# Altium schematic sheet Pressure_BMP280.SchDoc: BMP280
size 203 x 127 mm
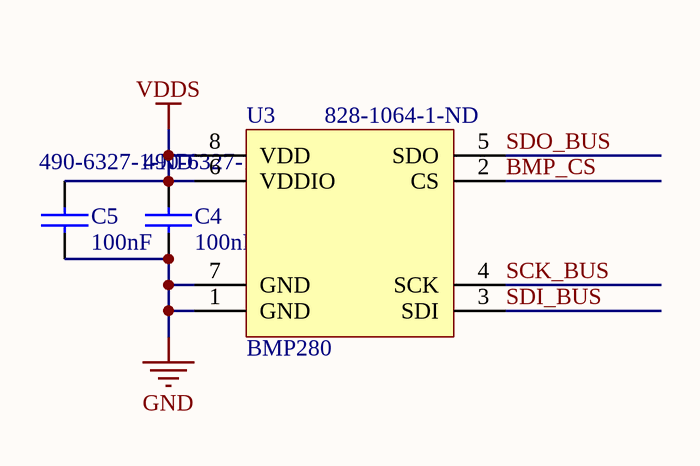
[diagram p0: Pressure_BMP280.SchDoc]

## Parts
C4  Supplier Part Number 1: 490-6327-1-ND  [0402[IMP]]  (hidden comment: 100nF)
C5  Supplier Part Number 1: 490-6327-1-ND  [0402[IMP]]  (hidden comment: 100nF)
U3  BMP280  Supplier Part Number 1: 828-1064-1-ND  [LGA-8]

## Nets
GND: C4.2 C5.2 U3.1(GND) U3.7(GND)
VDDS: C4.1 C5.1 U3.6(VDDIO) U3.8(VDD)
BMP_CS: U3.2(CS)
SCK_BUS: U3.4(SCK)
SDI_BUS: U3.3(SDI)
SDO_BUS: U3.5(SDO)

## Library data of the parts
C4 C5 = CAPACITOR: VOLTAGE: CMAX; CURRENT: CIMAX; KNEE: CBMAX; PSpiceTemplate: C^@REFDES %1 %2 ?TOLERANCE|C^@REFDES| @VALUE ?IC/IC=@IC/ TC=@TC1,@TC2 ?TOLERANCE|\n.model C^@REFDES CAP C=1 DEV=@TOLERANCE%|; DIST: FLAT; SLOPE: CSMAX; MAX_TEMP: CTMAX; TC1: 0; CLASS: DISCRETE; TC2: 0; Value: 100nF; Supplier 1: Digi-Key
U3 = BMP280: Supplier 1: Digi-Key